# Altium schematic sheet top.schdoc: SoRad: Top-Level Block Diagram
size A; Author: Chris Hiszpanski
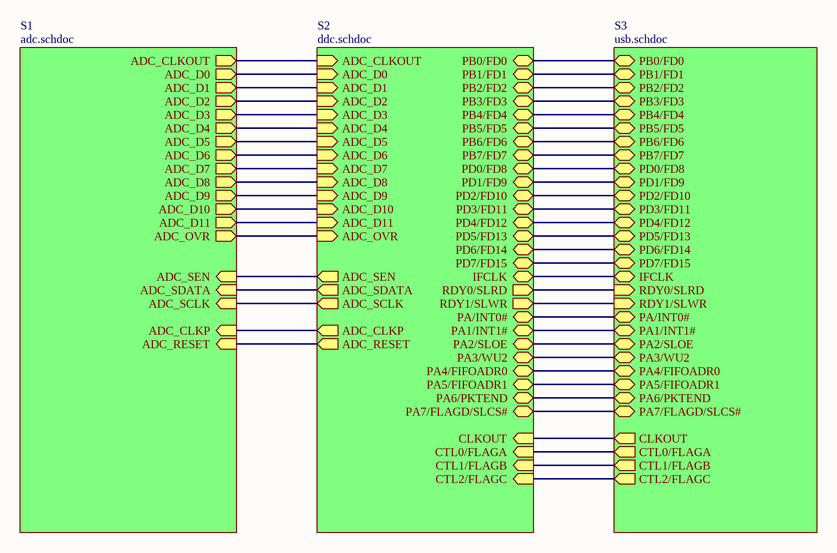
[diagram p0: top.schdoc]

## Sub-sheets
S1 = adc.schdoc: ADC_RESET (in), ADC_CLKP (in), ADC_SCLK (in), ADC_SDATA (in), ADC_SEN (in), ADC_CLKOUT (out), ADC_D0 (out), ADC_D1 (out), ADC_D2 (out), ADC_D3 (out), ADC_D4 (out), ADC_D5 (out), ADC_D6 (out), ADC_D7 (out), ADC_D8 (out), ADC_D9 (out), ADC_D10 (out), ADC_D11 (out), ADC_OVR (out)
S2 = ddc.schdoc: ADC_CLKOUT (in), ADC_D0 (in), ADC_D1 (in), ADC_D2 (in), ADC_D3 (in), ADC_D4 (in), ADC_D5 (in), ADC_D6 (in), ADC_D7 (in), ADC_D8 (in), ADC_D9 (in), ADC_D10 (in), ADC_D11 (in), ADC_OVR (in), ADC_RESET (out), ADC_CLKP (out), ADC_SCLK (out), ADC_SDATA (out), ADC_SEN (out), PB0/FD0 (bidir), PB3/FD3 (bidir), PB2/FD2 (bidir), PB1/FD1 (bidir), PB4/FD4 (bidir), PB5/FD5 (bidir), PB6/FD6 (bidir), PB7/FD7 (bidir), PD0/FD8 (bidir), PD1/FD9 (bidir), PD2/FD10 (bidir), PD3/FD11 (bidir), PD4/FD12 (bidir), PD5/FD13 (bidir), PD6/FD14 (bidir), PD7/FD15 (bidir), IFCLK (bidir), RDY0/SLRD (out), RDY1/SLWR (out), PA/INT0# (bidir), PA1/INT1# (bidir), PA2/SLOE (bidir), PA3/WU2 (bidir), PA4/FIFOADR0 (bidir), PA5/FIFOADR1 (bidir), PA6/PKTEND (bidir), PA7/FLAGD/SLCS# (bidir), CLKOUT (in), CTL0/FLAGA (in), CTL1/FLAGB (in), CTL2/FLAGC (in)
S3 = usb.schdoc: CTL2/FLAGC (out), CTL1/FLAGB (out), CTL0/FLAGA (out), PB0/FD0 (bidir), PB1/FD1 (bidir), PB2/FD2 (bidir), PB3/FD3 (bidir), PB4/FD4 (bidir), PB5/FD5 (bidir), PB6/FD6 (bidir), PB7/FD7 (bidir), PD0/FD8 (bidir), PD1/FD9 (bidir), PD2/FD10 (bidir), PD3/FD11 (bidir), PD4/FD12 (bidir), PD5/FD13 (bidir), PD6/FD14 (bidir), PD7/FD15 (bidir), IFCLK (bidir), CLKOUT (out), RDY0/SLRD (in), RDY1/SLWR (in), PA/INT0# (bidir), PA1/INT1# (bidir), PA2/SLOE (bidir), PA3/WU2 (bidir), PA4/FIFOADR0 (bidir), PA5/FIFOADR1 (bidir), PA6/PKTEND (bidir), PA7/FLAGD/SLCS# (bidir)

## Nets
(unnamed): sheet S1/ADC_RESET, sheet S2/ADC_RESET
(unnamed): sheet S1/ADC_CLKP, sheet S2/ADC_CLKP
(unnamed): sheet S1/ADC_SCLK, sheet S2/ADC_SCLK
(unnamed): sheet S1/ADC_SDATA, sheet S2/ADC_SDATA
(unnamed): sheet S1/ADC_SEN, sheet S2/ADC_SEN
(unnamed): sheet S1/ADC_CLKOUT, sheet S2/ADC_CLKOUT
(unnamed): sheet S1/ADC_D0, sheet S2/ADC_D0
(unnamed): sheet S1/ADC_D1, sheet S2/ADC_D1
(unnamed): sheet S1/ADC_D2, sheet S2/ADC_D2
(unnamed): sheet S1/ADC_D3, sheet S2/ADC_D3
(unnamed): sheet S1/ADC_D4, sheet S2/ADC_D4
(unnamed): sheet S1/ADC_D5, sheet S2/ADC_D5
(unnamed): sheet S1/ADC_D6, sheet S2/ADC_D6
(unnamed): sheet S1/ADC_D7, sheet S2/ADC_D7
(unnamed): sheet S1/ADC_D8, sheet S2/ADC_D8
(unnamed): sheet S1/ADC_D9, sheet S2/ADC_D9
(unnamed): sheet S1/ADC_D10, sheet S2/ADC_D10
(unnamed): sheet S1/ADC_D11, sheet S2/ADC_D11
(unnamed): sheet S1/ADC_OVR, sheet S2/ADC_OVR
(unnamed): sheet S2/PB0/FD0, sheet S3/PB0/FD0
(unnamed): sheet S2/PB3/FD3, sheet S3/PB3/FD3
(unnamed): sheet S2/PB2/FD2, sheet S3/PB2/FD2
(unnamed): sheet S2/PB1/FD1, sheet S3/PB1/FD1
(unnamed): sheet S2/PB4/FD4, sheet S3/PB4/FD4
(unnamed): sheet S2/PB5/FD5, sheet S3/PB5/FD5
(unnamed): sheet S2/PB6/FD6, sheet S3/PB6/FD6
(unnamed): sheet S2/PB7/FD7, sheet S3/PB7/FD7
(unnamed): sheet S2/PD0/FD8, sheet S3/PD0/FD8
(unnamed): sheet S2/PD1/FD9, sheet S3/PD1/FD9
(unnamed): sheet S2/PD2/FD10, sheet S3/PD2/FD10
(unnamed): sheet S2/PD3/FD11, sheet S3/PD3/FD11
(unnamed): sheet S2/PD4/FD12, sheet S3/PD4/FD12
(unnamed): sheet S2/PD5/FD13, sheet S3/PD5/FD13
(unnamed): sheet S2/PD6/FD14, sheet S3/PD6/FD14
(unnamed): sheet S2/PD7/FD15, sheet S3/PD7/FD15
(unnamed): sheet S2/IFCLK, sheet S3/IFCLK
(unnamed): sheet S2/RDY0/SLRD, sheet S3/RDY0/SLRD
(unnamed): sheet S2/RDY1/SLWR, sheet S3/RDY1/SLWR
(unnamed): sheet S2/PA/INT0#, sheet S3/PA/INT0#
(unnamed): sheet S2/PA1/INT1#, sheet S3/PA1/INT1#
(unnamed): sheet S2/PA2/SLOE, sheet S3/PA2/SLOE
(unnamed): sheet S2/PA3/WU2, sheet S3/PA3/WU2
(unnamed): sheet S2/PA4/FIFOADR0, sheet S3/PA4/FIFOADR0
(unnamed): sheet S2/PA5/FIFOADR1, sheet S3/PA5/FIFOADR1
(unnamed): sheet S2/PA6/PKTEND, sheet S3/PA6/PKTEND
(unnamed): sheet S2/PA7/FLAGD/SLCS#, sheet S3/PA7/FLAGD/SLCS#
(unnamed): sheet S2/CLKOUT, sheet S3/CLKOUT
(unnamed): sheet S2/CTL0/FLAGA, sheet S3/CTL0/FLAGA
(unnamed): sheet S2/CTL1/FLAGB, sheet S3/CTL1/FLAGB
(unnamed): sheet S2/CTL2/FLAGC, sheet S3/CTL2/FLAGC